# Altium schematic sheet NVMe_(Networking)_Ports.schdoc
size 135 x 295 mm
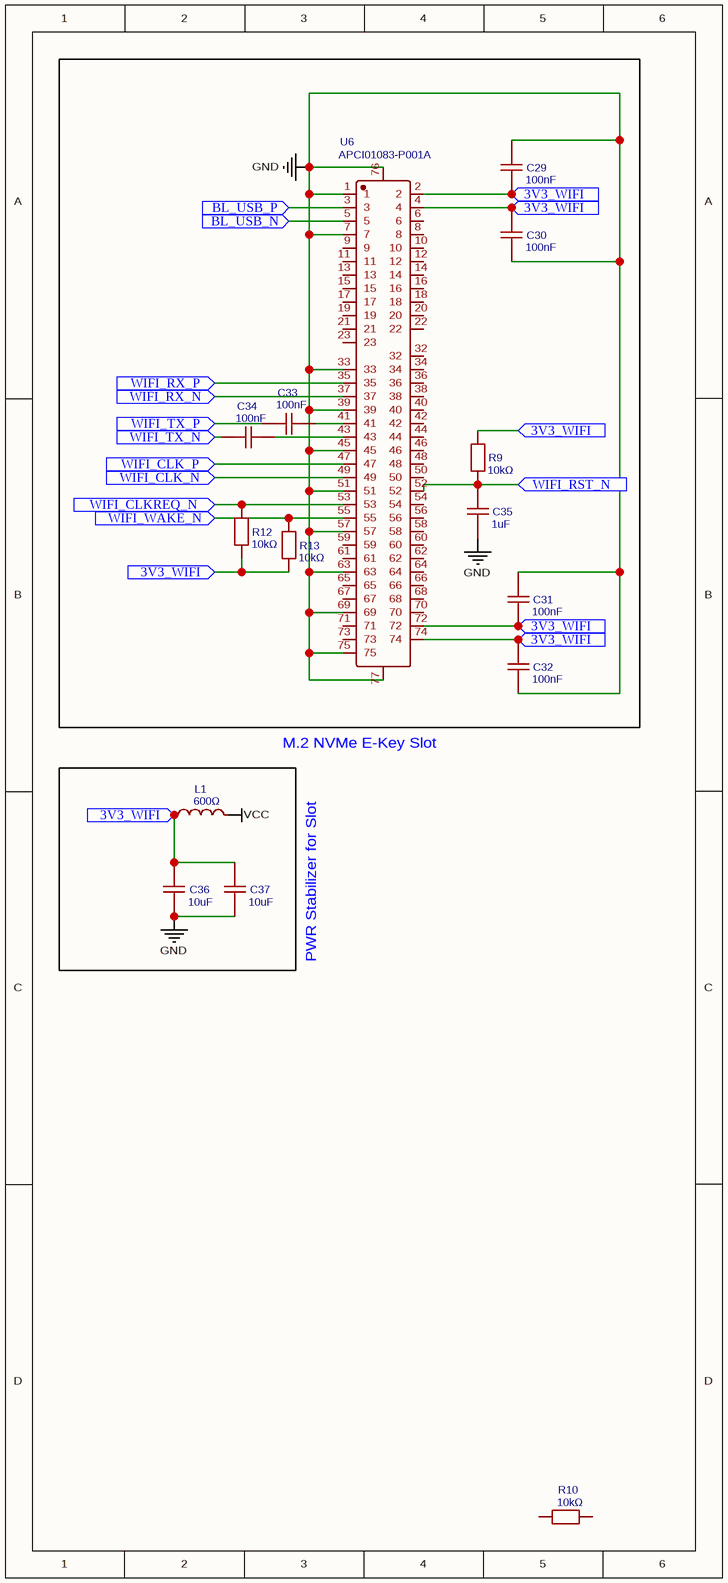
[diagram p0: NVMe_(Networking)_Ports.schdoc]

## Parts
C29  100nF  [C0402]
C30  100nF  [C0402]
C31  100nF  [C0402]
C32  100nF  [C0402]
C33  100nF  [C0402]
C34  100nF  [C0402]
C35  1uF  [C0402]
C36  10uF  [C0805]
C37  10uF  [C0805]
L1  600Ω  [L0805]
R9  10kΩ  [R0402]
R10  10kΩ  [R0402]
R12  10kΩ  [R0402]
R13  10kΩ  [R0402]
U6  APCI01083-P001A  [CONN-SMD_APCI01083-P001A]

## Blocks framed on the sheet
M.2 NVMe E-Key Slot: C36 C37 L1

## Ports
3V3_WIFI (in), BL_USB_N (in), BL_USB_P (in), WIFI_CLK_N (in), WIFI_CLK_P (in), WIFI_CLKREQ_N (in), WIFI_RST_N (in), WIFI_RX_N (in), WIFI_RX_P (in), WIFI_TX_N (in), WIFI_TX_P (in), WIFI_WAKE_N (in)

## Nets
GND: C29.2 C30.1 C31.2 C32.1 C35.1 C36.1 C37.1 U6.1 U6.7 U6.33 U6.39 U6.45 U6.51 U6.57 U6.63 U6.69 U6.75 U6.76 U6.77
VCC: L1.2
3V3_WIFI: C29.1 C30.2 C31.1 C32.2 C36.2 C37.2 L1.1 R9.2 R12.1 R13.1 U6.2 U6.4 U6.72 U6.74 ; port 3V3_WIFI
BL_USB_N: U6.5 ; port BL_USB_N
BL_USB_P: U6.3 ; port BL_USB_P
WIFI_CLK_N: U6.49 ; port WIFI_CLK_N
WIFI_CLK_P: U6.47 ; port WIFI_CLK_P
WIFI_CLKREQ_N: R12.2 U6.53 ; port WIFI_CLKREQ_N
WIFI_RST_N: C35.2 R9.1 U6.52 ; port WIFI_RST_N
WIFI_RX_N: U6.37 ; port WIFI_RX_N
WIFI_RX_P: U6.35 ; port WIFI_RX_P
WIFI_TX_N: C34.2 ; port WIFI_TX_N
WIFI_TX_P: C33.2 ; port WIFI_TX_P
WIFI_WAKE_N: R13.2 U6.55 ; port WIFI_WAKE_N
NetC33_1: C33.1 U6.41
NetC34_1: C34.1 U6.43

Not connected (* = marked no-connect by the designer): R10 1 2; U6 6 8 9 10 11 12 13 14 15 16 17 18 19 20 21 22 23 32 34 36 38 40 42 44 46 48 50 54 56 58 59 60 61 62 64 65 66 67 68 70 71 73

## Notes on the sheet
- PWR Stabilizer for Slot

## Library data of the parts
C29-C34 = 100nF: Manufacturer: YAGEO(国巨); Manufacturer Part: CC0402KRX5R6BB104; nameAlias: Value; Contributor: LCSC; Supplier: LCSC; Supplier Part: C129131; JLCPCB Part Class: Extended Part; spicePre: C; spiceSymbolName: CC0402KRX5R6BB104
C35 = 1uF: Manufacturer: CCTC(三环); Manufacturer Part: TCC0402X5R105K160AT; Contributor: lcsc; nameAlias: Value; Supplier: LCSC; Supplier Part: C5142580; JLCPCB Part Class: Extended Part; spicePre: C; spiceSymbolName: TCC0402X5R105K160AT
C36 C37 = 10uF: Manufacturer: HRE(芯声); Manufacturer Part: CGA0805X5R106K500MT; nameAlias: Value; Contributor: lcsc; Supplier: LCSC; Supplier Part: C6119889; JLCPCB Part Class: Extended Part; spicePre: C; spiceSymbolName: CGA0805X5R106K500MT
L1 = 600Ω: Manufacturer: TDK; Manufacturer Part: MPZ2012S601AT000; nameAlias: Value; Supplier: LCSC; Supplier Part: C21519; JLCPCB Part Class: Extended Part; spicePre: L; spiceSymbolName: MPZ2012S601AT000
R9 R10 R12 R13 = 10kΩ: Manufacturer: FOJAN(富捷); Manufacturer Part: FRC0402F1002TS; nameAlias: Value; Contributor: LCSC; Supplier: LCSC; Supplier Part: C2906861; JLCPCB Part Class: Extended Part; spicePre: R; spiceSymbolName: FRC0402F1002TS
  R10 R12 R13: link: https://lcsc.com/eda_search?q=C2906861&%26type=1&ref=editor
U6 = APCI01083-P001A: Manufacturer: LX(连欣科技); Contributor: lcsc; Supplier: LCSC; Supplier Part: C41425435; Manufacturer Part: APCI01083-P001A; JLCPCB Part Class: Extended Part; spicePre: U; spiceSymbolName: APCI01083-P001A